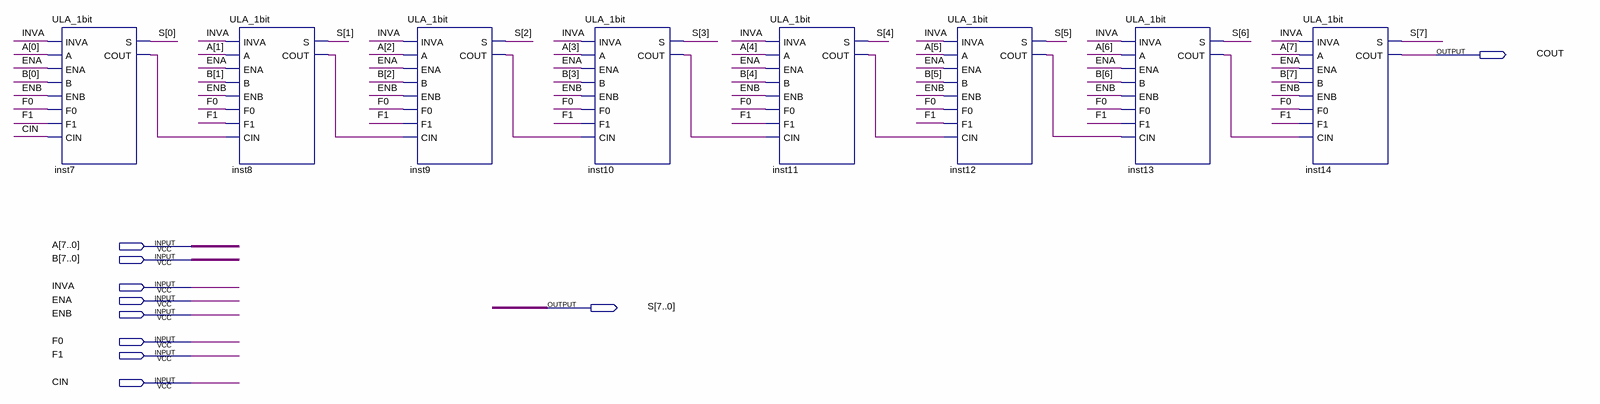
[diagram p0: schematic sheet]
// Quartus schematic ULA_8bits.bdf as structural Verilog: 8 symbols, 10 pins
module ULA_8bits (
  input  [7:0] A,
  input  [7:0] B,
  input  INVA,
  input  ENA,
  input  ENB,
  input  F0,
  input  F1,
  input  CIN,
  output COUT,
  output [7:0] S
);

  wire inst7_cout, inst8_cout, inst9_cout, inst10_cout, inst11_cout, inst12_cout, inst13_cout;

  ULA_1bit inst7 (
    .INVA(INVA), .A(A[0]), .ENA(ENA), .B(B[0]), .ENB(ENB), .F0(F0), .F1(F1), .CIN(CIN), .S(S[0]),
    .COUT(inst7_cout));
  ULA_1bit inst8 (
    .INVA(INVA), .A(A[1]), .ENA(ENA), .B(B[1]), .ENB(ENB), .F0(F0), .F1(F1), .CIN(inst7_cout), .S(S[1]),
    .COUT(inst8_cout));
  ULA_1bit inst9 (
    .INVA(INVA), .A(A[2]), .ENA(ENA), .B(B[2]), .ENB(ENB), .F0(F0), .F1(F1), .CIN(inst8_cout), .S(S[2]),
    .COUT(inst9_cout));
  ULA_1bit inst10 (
    .INVA(INVA), .A(A[3]), .ENA(ENA), .B(B[3]), .ENB(ENB), .F0(F0), .F1(F1), .CIN(inst9_cout), .S(S[3]),
    .COUT(inst10_cout));
  ULA_1bit inst11 (
    .INVA(INVA), .A(A[4]), .ENA(ENA), .B(B[4]), .ENB(ENB), .F0(F0), .F1(F1), .CIN(inst10_cout), .S(S[4]),
    .COUT(inst11_cout));
  ULA_1bit inst12 (
    .INVA(INVA), .A(A[5]), .ENA(ENA), .B(B[5]), .ENB(ENB), .F0(F0), .F1(F1), .CIN(inst11_cout), .S(S[5]),
    .COUT(inst12_cout));
  ULA_1bit inst13 (
    .INVA(INVA), .A(A[6]), .ENA(ENA), .B(B[6]), .ENB(ENB), .F0(F0), .F1(F1), .CIN(inst12_cout), .S(S[6]),
    .COUT(inst13_cout));
  ULA_1bit inst14 (
    .INVA(INVA), .A(A[7]), .ENA(ENA), .B(B[7]), .ENB(ENB), .F0(F0), .F1(F1), .CIN(inst13_cout), .S(S[7]),
    .COUT(COUT));
endmodule
